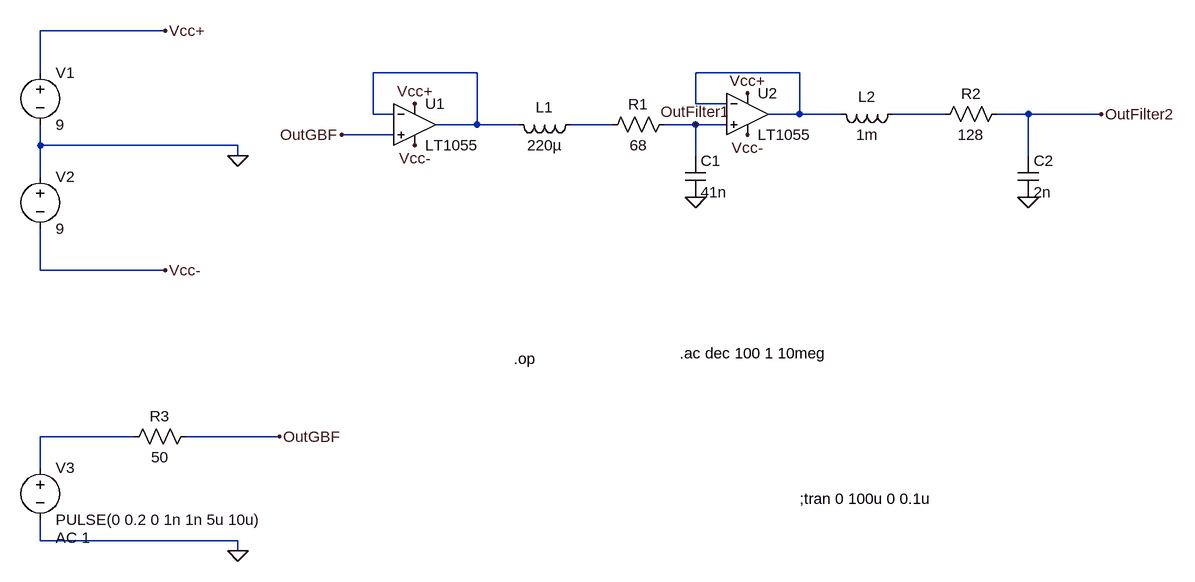
[diagram p0: schematic filtre anti repliement.asc]
filtre anti repliement.asc, the LTspice schematic file:
Version 4
SHEET 1 1336 680
WIRE -240 -432 -432 -432
WIRE -432 -368 -432 -432
WIRE 240 -368 80 -368
WIRE 736 -368 576 -368
WIRE 576 -320 576 -368
WIRE 624 -320 576 -320
WIRE 80 -304 80 -368
WIRE 112 -304 80 -304
WIRE 736 -304 736 -368
WIRE 736 -304 688 -304
WIRE 800 -304 736 -304
WIRE 960 -304 880 -304
WIRE 1088 -304 1040 -304
WIRE 1200 -304 1088 -304
WIRE 240 -288 240 -368
WIRE 240 -288 176 -288
WIRE 304 -288 240 -288
WIRE 448 -288 384 -288
WIRE 576 -288 528 -288
WIRE 624 -288 576 -288
WIRE 112 -272 32 -272
WIRE -432 -256 -432 -288
WIRE -128 -256 -432 -256
WIRE -128 -240 -128 -256
WIRE 576 -240 576 -288
WIRE 1088 -240 1088 -304
WIRE -432 -208 -432 -256
WIRE -432 -64 -432 -128
WIRE -240 -64 -432 -64
WIRE -288 192 -432 192
WIRE -64 192 -208 192
WIRE -432 240 -432 192
WIRE -432 352 -432 320
WIRE -128 352 -432 352
WIRE -128 368 -128 352
FLAG -128 -240 0
FLAG -128 368 0
FLAG 1088 -176 0
FLAG 576 -176 0
FLAG -240 -432 Vcc+
FLAG -240 -64 Vcc-
FLAG -64 192 OutGBF
FLAG 32 -272 OutGBF
FLAG 144 -320 Vcc+
FLAG 656 -336 Vcc+
FLAG 144 -256 Vcc-
FLAG 656 -272 Vcc-
FLAG 576 -288 OutFilter1
FLAG 1200 -304 OutFilter2
SYMBOL res 544 -304 R90
WINDOW 0 0 56 VBottom 2
WINDOW 3 32 56 VTop 2
SYMATTR InstName R1
SYMATTR Value 68
SYMBOL res 1056 -320 R90
WINDOW 0 0 56 VBottom 2
WINDOW 3 32 56 VTop 2
SYMATTR InstName R2
SYMATTR Value 128
SYMBOL ind 400 -304 R90
WINDOW 0 5 56 VBottom 2
WINDOW 3 32 56 VTop 2
SYMATTR InstName L1
SYMATTR Value 220µ
SYMATTR SpiceLine Ipk=0.6 Rser=0.75 Rpar=144700 Cpar=3.235p mfg="Bourns, Inc." pn="SDE0805A-221K"
SYMBOL ind 896 -320 R90
WINDOW 0 5 56 VBottom 2
WINDOW 3 32 56 VTop 2
SYMATTR InstName L2
SYMATTR Value 1m
SYMATTR SpiceLine Ipk=0.135 Rser=11.5 Rpar=408191 Cpar=0 mfg="Bourns, Inc." pn="SDR0503-102KL"
SYMBOL OpAmps\\LT1055 144 -352 R0
SYMATTR InstName U1
SYMBOL OpAmps\\LT1055 656 -368 R0
SYMATTR InstName U2
SYMBOL cap 560 -240 R0
SYMATTR InstName C1
SYMATTR Value 41n
SYMBOL cap 1072 -240 R0
SYMATTR InstName C2
SYMATTR Value 2n
SYMBOL voltage -432 -384 R0
WINDOW 123 0 0 Left 0
WINDOW 39 0 0 Left 0
SYMATTR InstName V1
SYMATTR Value 9
SYMBOL voltage -432 -224 R0
WINDOW 123 0 0 Left 0
WINDOW 39 0 0 Left 0
SYMATTR InstName V2
SYMATTR Value 9
SYMBOL voltage -432 224 R0
WINDOW 123 24 124 Left 2
WINDOW 39 0 0 Left 0
SYMATTR Value2 AC 1
SYMATTR InstName V3
SYMATTR Value PULSE(0 0.2 0 1n 1n 5u 10u)
SYMBOL res -192 176 R90
WINDOW 0 0 56 VBottom 2
WINDOW 3 32 56 VTop 2
SYMATTR InstName R3
SYMATTR Value 50
TEXT 296 72 Left 2 !.op
TEXT 552 64 Left 2 !.ac dec 100 1 10meg
TEXT 736 288 Left 2 !;tran 0 100u 0 0.1u

The netlist it stands for:
* filtre anti repliement.asc
R1 OutFilter1 N004 68
R2 OutFilter2 N003 128
L1 N004 N001 220µ Ipk=0.6 Rser=0.75 Rpar=144700 Cpar=3.235p mfg="Bourns, Inc." pn="SDE0805A-221K"
L2 N003 N002 1m Ipk=0.135 Rser=11.5 Rpar=408191 Cpar=0 mfg="Bourns, Inc." pn="SDR0503-102KL"
XU1 OutGBF N001 Vcc+ Vcc- N001 LT1055  ; pins In+ In- V+ V- OUT
XU2 OutFilter1 N002 Vcc+ Vcc- N002 LT1055  ; pins In+ In- V+ V- OUT
C1 OutFilter1 0 41n
C2 OutFilter2 0 2n
V1 Vcc+ 0 9
V2 0 Vcc- 9
V3 N005 0 PULSE(0 0.2 0 1n 1n 5u 10u) AC 1
R3 OutGBF N005 50
.op
.ac dec 100 1 10meg
;tran 0 100u 0 0.1u
.backanno
.end

* Results of the author's LTspice run, read from the files saved beside the schematic
* Operating Point, zero values left out:
*   V(vcc+) = 9 V
*   V(vcc-) = -9 V
*   I(V2) = -5.6 mA
*   I(V1) = -5.6 mA
*   Ix(u1:3) = 2.8 mA
*   Ix(u1:4) = -2.8 mA
*   Ix(u2:3) = 2.8 mA
*   Ix(u2:4) = -2.8 mA
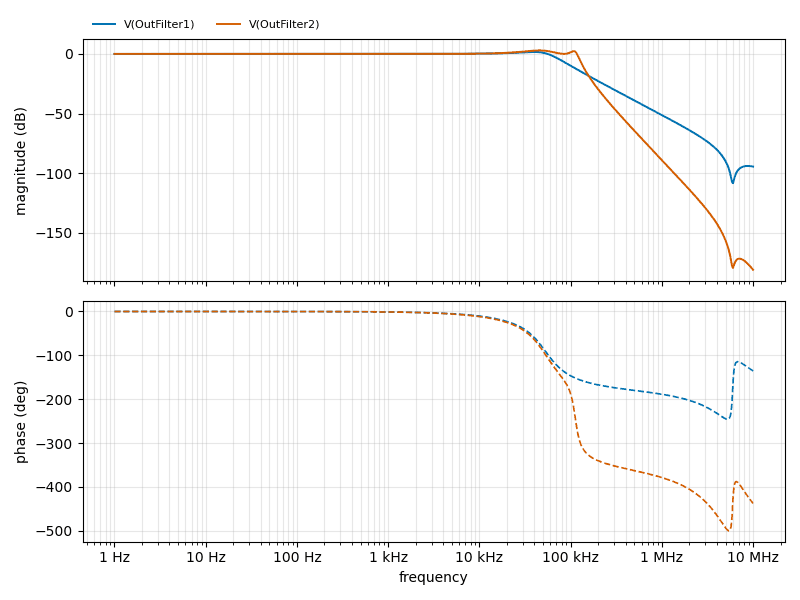
[diagram p1: AC Analysis of filtre anti repliement.asc, plotted from the saved traces]
* AC Analysis, 1 run:
*   V(OutFilter1): -0.00 dB at 1 Hz, -94.54 dB at 10 MHz, peak 1.64 dB at 39.81 kHz, 3 dB below the peak at 62.29 kHz
*   V(OutFilter2): -0.00 dB at 1 Hz, -181.06 dB at 10 MHz, peak 2.95 dB at 45.71 kHz, 3 dB below the peak at 117.4 kHz
* From the log:
*   Semiconductor Device Operating Points:
*                           --- Diodes ---
*   Name:    d:u2:3      d:u2:6      d:u2:5      d:u2:4      d:u2:1
*   Model:    u2:dc       u2:y        u2:y        u2:x        u2:x
*   Id:      1.00e-04    2.41e-29   -2.41e-29   -9.00e-11   -9.00e-11
*   Vd:      1.80e+01    2.41e-17   -2.41e-17   -9.00e+00   -9.00e+00
*   Req:     1.00e-02    1.00e-12    1.00e-12    1.00e-11    1.00e-11
*   CAP:     0.00e+00    0.00e+00    0.00e+00    0.00e+00    0.00e+00
*   Name:    d:u1:3      d:u1:6      d:u1:5      d:u1:4      d:u1:1
*   Model:    u1:dc       u1:y        u1:y        u1:x        u1:x
*   Id:      1.00e-04    0.00e+00    0.00e+00   -9.00e-11   -9.00e-11
*   Vd:      1.80e+01    0.00e+00    0.00e+00   -9.00e+00   -9.00e+00
*   Req:     1.00e-02    1.00e-12    1.00e-12    1.00e-11    1.00e-11
*   CAP:     0.00e+00    0.00e+00    0.00e+00    0.00e+00    0.00e+00
*                           --- VDMOSFET Transistors ---
*   Name:        m:u2:2      m:u2:1      m:u1:2      m:u1:1
*   Model:        u2:p        u2:n        u1:p        u1:n
*   Id:         -2.70e-03    2.70e-03   -2.70e-03    2.70e-03
*   Vgs:        -2.41e-17   -2.41e-17    0.00e+00    0.00e+00
*   Vds:        -9.00e+00    9.00e+00   -9.00e+00    9.00e+00
*   Vth:         3.00e-01   -3.00e-01    3.00e-01   -3.00e-01
*   Gm:          1.80e-02    1.80e-02    1.80e-02    1.80e-02
*   Gds:         0.00e+00    0.00e+00    0.00e+00    0.00e+00
*   Cgs:         0.00e+00    0.00e+00    0.00e+00    0.00e+00
*   Cgd:         0.00e+00    0.00e+00    0.00e+00    0.00e+00
*   Cbody:       0.00e+00    0.00e+00    0.00e+00    0.00e+00